# EasyEDA Pro project STM32F407VET6飞控.eprj

# Schematic STM32F407VET6飞控
Board Name: Board1; Create Date: 2025-07-30; Page Name: 核心原理图; Project Name: STM32F407VET6飞控; Schematic Name: STM32F407VET6飞控; Update Date: 2025-11-22; Company: 嘉立创EDA; Drawed: 黎佳鑫; Page Size: A4; Version: V1.0
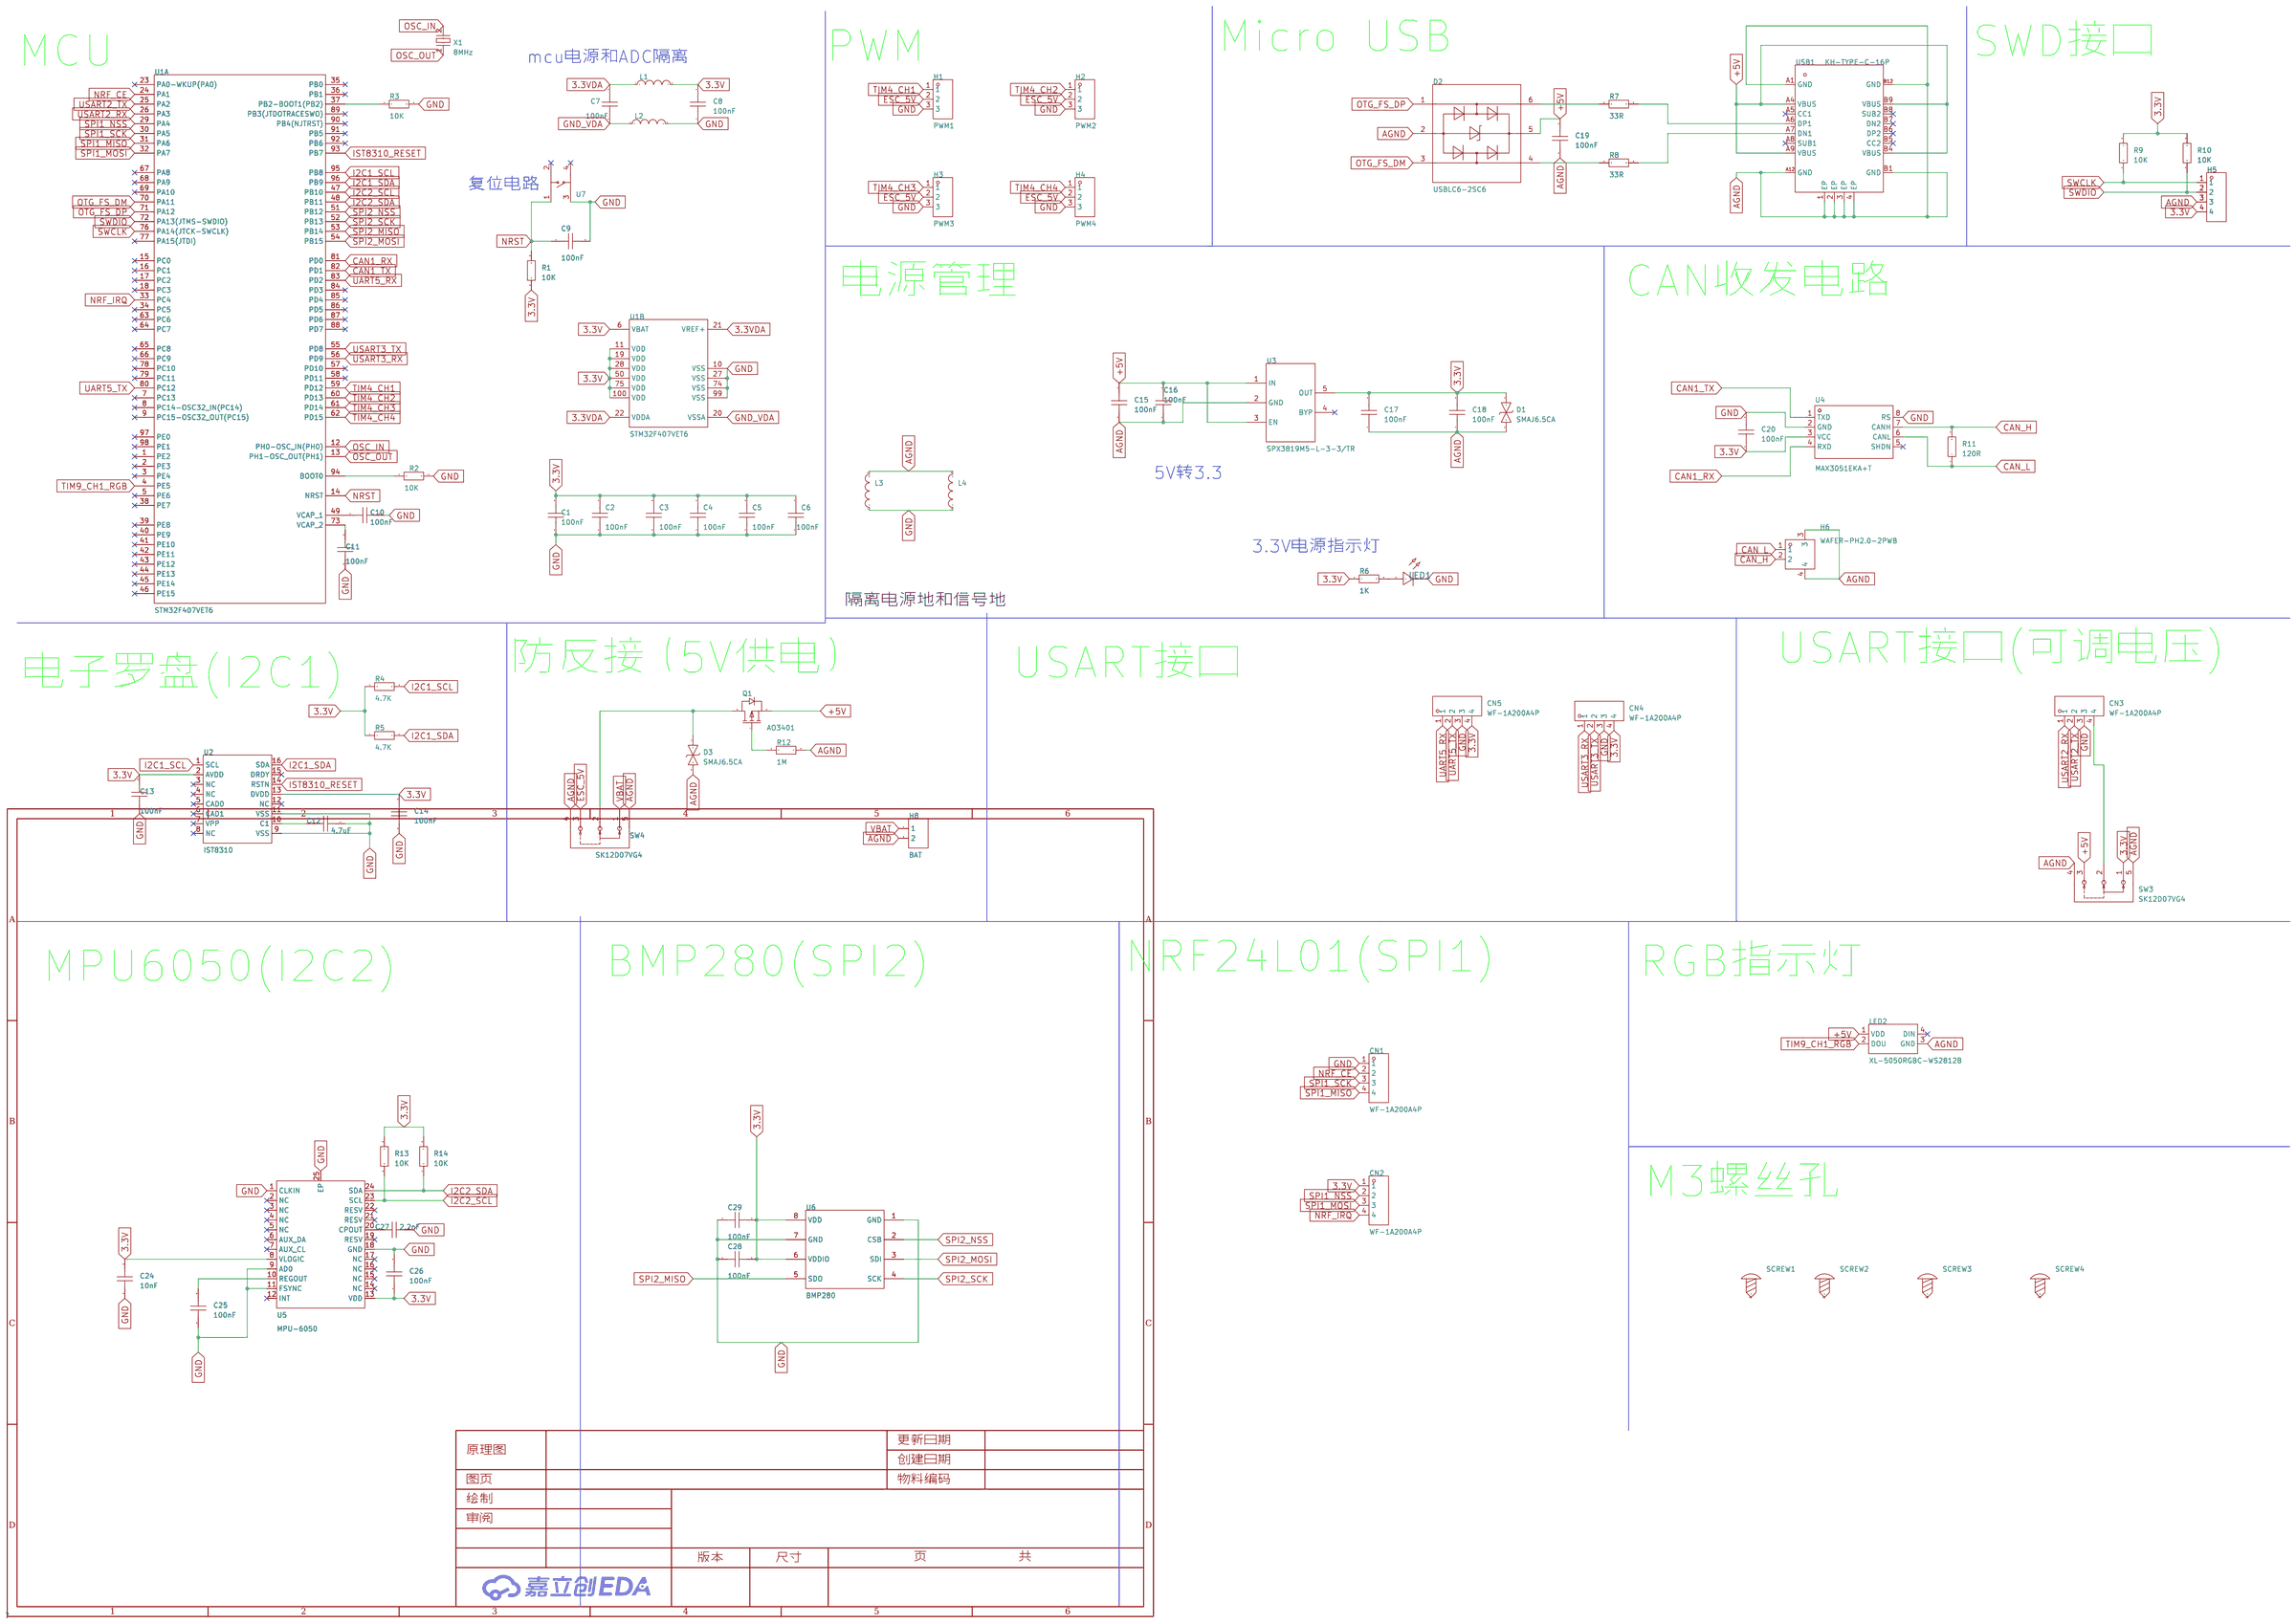
[diagram p0: schematic sheet]

## Parts
C1  100nF  [C0603]
C2  100nF  [C0603]
C3  100nF  [C0603]
C4  100nF  [C0603]
C5  100nF  [C0603]
C6  100nF  [C0603]
C7  100nF  [C0603]
C8  100nF  [C0603]
C9  100nF  [C0603]
C10  100nF  [C0603]
C11  100nF  [C0603]
C12  4.7uF  [C0603]
C13  100nF  [C0603]
C14  100nF  [C0603]
C15  100nF  [C0603]
C16  100nF  [C0603]
C17  100nF  [C0603]
C18  100nF  [C0603]
C19  100nF  [C0603]
C20  100nF  [C0603]
C24  10nF  [C0603]
C25  100nF  [C0603]
C26  100nF  [C0603]
C27  2.2nF  [C0603]
C28  100nF  [C0603]
C29  100nF  [C0603]
CN1  WF-1A200A4P  [CONN-TH_4P-P2.00_PH2.0-4P-1]
CN2  WF-1A200A4P  [CONN-TH_4P-P2.00_PH2.0-4P-1]
CN3  WF-1A200A4P  [CONN-TH_4P-P2.00_PH2.0-4P-1]
CN4  WF-1A200A4P  [CONN-TH_4P-P2.00_PH2.0-4P-1]
CN5  WF-1A200A4P  [CONN-TH_4P-P2.00_PH2.0-4P-1]
D1  SMAJ6.5CA  [SMA_L4.3-W2.7-LS5.0-BI]
D2  USBLC6-2SC6  [SOT-23-6_L2.9-W1.6-P0.95-LS2.8-BL]
D3  SMAJ6.5CA  [SMA_L4.3-W2.7-LS5.0-BI]
H1  PWM1  [HDR-TH_3P-P2.54-V-F]
H2  PWM2  [HDR-TH_3P-P2.54-V-F]
H3  PWM3  [HDR-TH_3P-P2.54-V-F]
H4  PWM4  [HDR-TH_3P-P2.54-V-F]
H5  -  [HDR-TH_4P-P2.54-V-F]
H6  WAFER-PH2.0-2PWB  [CONN-SMD_2P-P2.00_XUNPU_WAFER-PH2.0-2PWB]
H8  BAT  [HDR-TH_2P-P2.54-V-F]
L1  CBG160808U000T  [L0603]
L2  CBG160808U000T  [L0603]
L3  CBG160808U000T  [L0603]
L4  CBG160808U000T  [L0603]
LED1  -  [LED_0603]
LED2  XL-5050RGBC-WS2812B  [LED-SMD_4P-L5.0-W5.0-BL_XL-5050RGBC]
Q1  AO3401  [SOT-23-3_L2.9-W1.4-P1.90-LS2.6-BR]
R1  10K  [R0603]
R2  10K  [R0603]
R3  10K  [R0603]
R4  4.7K  [R0603]
R5  4.7K  [R0603]
R6  1K  [R0603]
R7  33R  [R0603]
R8  33R  [R0603]
R9  10K  [R0603]
R10  10K  [R0603]
R11  120R  [R0603]
R12  1M  [R0603]
R13  10K  [R0603]
R14  10K  [R0603]
SCREW1  -  [M3螺丝]
SCREW2  -  [M3螺丝]
SCREW3  -  [M3螺丝]
SCREW4  -  [M3螺丝]
SW3  SK12D07VG4  [SW-TH_SK12D07VG4]
SW4  SK12D07VG4  [SW-TH_SK12D07VG4]
U1  STM32F407VET6  [LQFP-100_L14.0-W14.0-P0.50-LS16.0-BL]  (sections 1,2)
U2  IST8310  [LGA-16_L3.0-W3.0-P0.50-BL_SQ]
U3  SPX3819M5-L-3-3/TR  [SOT-23-5_L3.0-W1.7-P0.95-LS2.8-BL]
U4  MAX3051EKA+T  [SOT-23-8_L3.0-W1.7-P0.65-LS2.8-TL]
U5  MPU-6050  [QFN-24_L4.0-W4.0-P0.50-BL-EP2.7]
U6  BMP280  [LGA-8_L2.5-W2.0-P0.65_AMP6127]
U7  TPS645-5NC60  [SW-SMD_4P-L6.0-W6.0-P4.50-LS9.2]
USB1  KH-TYPE-C-16P  [USB-C-SMD_KH-TYPE-C-16P]
X1  8MHz  [OSC-SMD_2P-L3.2-W2.5]

## Library data of the parts
C1-C20 C24-C29 = CAP_0603: Supplier Footprint: 0603
CN1-CN5 = WF-1A200A4P: LCSC Part Name: 间距2.0mm 直插 1x4P; Supplier Part: C23396960; Manufacturer: BXCONN(宝讯); Supplier Footprint: 插件,P=2mm; JLCPCB Part Class: 扩展库; Datasheet: https://atta.szlcsc.com/upload/public/pdf/source/20240628/5C536E6C8BD8BF2E5C6C6F2EC1BCB864.pdf; Supplier: LCSC; Pins Structure: 1x4P; Pitch: 2mm; Mounting Style: 直插; Reference Series: PH; Number of Pins: 4P; Number of Rows: 1; Number of PINs Per Row: 4; Current Rating (Max): 2A; Contact Material: 黄铜; Contact Plating: 锡; Operating Temperature Range: -25℃~+85℃
D1 D3 = SMAJ6.5CA_C908811: LCSC Part Name: 双向TVS 6.5V截止 35.7A峰值脉冲; Supplier Part: C908811; Manufacturer: GOODWORK(固得沃克); Supplier Footprint: SMA(DO-214AC); JLCPCB Part Class: 扩展库; Datasheet: https://atta.szlcsc.com/upload/public/pdf/source/20250421/E5E6656BCE61AA6110B0AF0D0BBE47DA.pdf; Supplier: LCSC; Reverse Stand-Off Voltage (Vrwm): 6.5V; Clamping Voltage: 11.2V; Peak Pulse Current (Ipp): 35.7A; Peak Pulse Power Dissipation (Ppp): 400W; Voltage - Breakdown: 7.22V; Reverse Leakage Current (Ir): 500uA; Operating Temperature: -55℃~+150℃@(Tj); Type: TVS
D2 = USBLC6-2SC6_C7519: LCSC Part Name: 单向ESD; Supplier Part: C7519; Manufacturer: ST(意法半导体); Supplier Footprint: SOT-23-6; JLCPCB Part Class: 扩展库; Datasheet: https://atta.szlcsc.com/upload/public/pdf/source/20140724/1457707160627.pdf; Supplier: LCSC; polarity: 单向; Reverse Stand-Off Voltage (Vrwm): 5.25V; Maximum Clamping Voltage: 17V; Peak Pulse Current (Ipp)@10/1000us: 5A; Breakdown Voltage: 6V; Number of Lines: 双路; Operating Temperature: -40℃~+125℃@(Tj); Type: ESD
H1-H4 = HDR-F_2.54_1x3P: Supplier Part: C541850; Supplier Footprint: 插件
H5 = HDR-F_2.54_1x4P: Supplier Part: C2718488; Supplier Footprint: 插件
H6 = WAFER-PH2.0-2PWB: LCSC Part Name: 1x2P 间距:2mm 卧贴 系列:PH; Supplier Part: C3029440; Manufacturer: XUNPU(讯普); Supplier Footprint: SMD,P=2mm,卧贴; JLCPCB Part Class: 扩展库; Datasheet: https://atta.szlcsc.com/upload/public/pdf/source/20220527/83903C18429EFE4C9EEE8C529A248431.pdf; Supplier: LCSC; Pins Structure: 1x2P; Pitch: 2mm; Mounting Type: 卧贴; Reference Series: PH; Number of Pins: 2P; Number of Rows: 1; Number of PINs Per Row: 2; Current Rating: 2A; Contact Material: 黄铜; Operating Temperature: -25℃~+85℃; Voltage Rating: 250V; Plastic Material: LCP; Supplementary Features: 辅助焊脚; Color: 米色; Z-Height of the Board: 5.6mm; X-Length of Bottom Edge on Board (Spacing Line): 8mm; Y-Width of Bottom Edge on Board: 8.5mm
H8 = HDR-F_2.54_1x2P: Supplier Part: C49661; Supplier Footprint: 插件
L1-L4 = CBG160808U000T: LCSC Part Name: 单路 0603磁珠 阻抗0Ω@100MHz; Supplier Part: C43163; Manufacturer: FH(风华); Supplier Footprint: 0603; JLCPCB Part Class: 扩展库; Datasheet: https://atta.szlcsc.com/upload/public/pdf/source/20190129/C361667_1614D407CC98D1D3CFBD9E1F7511C14D.pdf; Supplier: LCSC; Impedance @ Frequency: 0Ω@100MHz; DC Resistance: 100mΩ; Current Rating: 800mA; Circuits: 1
LED1 = LED_0603-R: Supplier Footprint: 0603
LED2 = XL-5050RGBC-WS2812B: Supplier Part: C2843785; Manufacturer: XINGLIGHT(成兴光); Supplier Footprint: SMD5050; JLCPCB Part Class: 扩展库; Datasheet: https://atta.szlcsc.com/upload/public/pdf/source/20240412/E1004CAA80592E31D08BFE019083806F.pdf; Supplier: LCSC
Q1 = AO3401_C727156: 类型:P沟道;漏源电压(Vdss):30V;连续漏极电流(Id):4.2A;功率(Pd):350mW;导通电阻(RDS(on)@Vgs,Id):65mΩ@10V,4.2A;阈值电压(Vgs(th)@Id):1.3V@250uA;; LCSC Part Name: P沟道 耐压:30V 电流:4.2A; Supplier Part: C727156; Manufacturer: TWGMC(台湾迪嘉); Supplier Footprint: SOT-23; JLCPCB Part Class: 扩展库; Datasheet: https://atta.szlcsc.com/upload/public/pdf/source/20200827/C727156_6E081BBEEFBC6B8FEE164CB196B0AF30.pdf; Supplier: LCSC; Type: P沟道; Drain Source Voltage (Vdss): 30V; Continuous Drain Current (Id): 4.2A; Power Dissipation (Pd): 350mW; Drain Source On Resistance (RDS(on)@Vgs,Id): 65mΩ@10V,4.2A; Gate Threshold Voltage (Vgs(th)@Id): 1.3V@250uA
R1-R14 = Res_0603: Supplier Footprint: 0603
SCREW1-SCREW4 = M3螺丝: Supplier Footprint: 插件
SW3 SW4 = SK12D07VG4: 电路结构:单刀双掷;安装方式:-;额定电流(DC):500mA;额定电压(DC):50V;额定电流(AC):-;额定电压(AC):-;机械寿命:5千次;; LCSC Part Name: 3脚2档位 卧插 滑动开关; Supplier Part: C393937; Manufacturer: SHOU HAN(首韩); Supplier Footprint: 插件; Datasheet: https://atta.szlcsc.com/upload/public/pdf/source/20190521/C393937_939FE26E571CC67D2D532E953108A1B0.pdf; Supplier: LCSC; Circuit: 单刀双掷; Actuator Style: 矩形柱状; Pin Style: PC引脚; Switch Height: 8.8mm; Current Rating (DC): 500mA; Voltage Rating (DC): 50V; Mechanical Life: 5千次
U1 = STM32F407VET6: LCSC Part Name: 带DSP和FPU的高性能基础系列ARM Cortex-M4 MCU，具有512 KB Flash、168 MHz CPU、ART加速器、以太网和FSMC; Supplier Part: C28730; Manufacturer: ST(意法半导体); Supplier Footprint: LQFP-100(14x14); JLCPCB Part Class: 扩展库; Datasheet: https://atta.szlcsc.com/upload/public/pdf/source/20140801/1457707197138.pdf; Supplier: LCSC; CPU Core: ARM-M4; CPU Maximum Speed: 168MHz; Program Storage Size: 512KB; Program Memory Type: FLASH; Number of I/O: 82; ADC (Bit): 12bit; DAC (Bit): 12bit; Voltage - Supply: 1.8V~3.6V
U2 = IST8310_C2683055: Supplier Part: C2683055; Manufacturer: iSentek(爱盛科技); Supplier Footprint: LGA-16(3x3); JLCPCB Part Class: 扩展库; Datasheet: https://atta.szlcsc.com/upload/public/pdf/source/20250224/70FB1E25A3B1BEF4BDD1315496E152E4.pdf; Supplier: LCSC
U3 = SPX3819M5-L-3-3/TR: LCSC Part Name: 输入16V 输出3.3V 500mA; Supplier Part: C9055; Manufacturer: MaxLinear(迈凌); Supplier Footprint: SOT-23-5; JLCPCB Part Class: 扩展库; Datasheet: https://atta.szlcsc.com/upload/public/pdf/source/20150720/1457707331934.pdf; Supplier: LCSC; Output Type: 固定; Voltage - Supply: 16V; Output Voltage: 3.3V; Output Current: 500mA; Power Supply Rejection Ratio (PSRR): 70dB; Voltage Dropout: 340mV@(500mA); standby current: 90uA; Noise: 40uVrms; Features: 带使能；过热保护；过流保护; Operating Temperature: -40℃~+125℃; Output Configuration: 正极; Number of Outputs: 1
U4 = MAX3051EKA+T: LCSC Part Name: MAX3051 +3.3V, 1Mbps, 低电源电流 CAN 收发器; Supplier Part: C112005; Manufacturer: ADI(亚德诺)/MAXIM(美信); Supplier Footprint: SOT-23-8; JLCPCB Part Class: 扩展库; Datasheet: https://atta.szlcsc.com/upload/public/pdf/source/20180126/C143406_15169558780381308928.pdf; Supplier: LCSC; Type: CAN收发器; Data Rate: 1Mbps; Supply Voltage: 3.3V; Supply Current: 35mA; Operating Temperature: -40℃~+85℃
U5 = MPU-6050: Supplier Part: C24112; Manufacturer: TDK InvenSense(应美盛); Supplier Footprint: QFN-24-EP(4x4); JLCPCB Part Class: 扩展库; Datasheet: https://atta.szlcsc.com/upload/public/pdf/source/20140425/1457707046159.pdf; Supplier: LCSC; Sensor Type: 加速度计陀螺仪; Operating Temperature: -40℃~+85℃
U6 = BMP280: LCSC Part Name: BMP280 停产; Supplier Part: C83291; Manufacturer: Bosch(博世); Supplier Footprint: LGA-8(2x2.5); JLCPCB Part Class: 扩展库; Datasheet: https://atta.szlcsc.com/upload/public/pdf/source/20200702/C83291_F39E84AB7DFC569A4C7554F8659640A1.pdf; Supplier: LCSC
U7 = TPS645-5NC60: LCSC Part Name: 6X6X6H 260克力 贴片轻触开关; Supplier Part: C19191552; Manufacturer: ROCPU Switches(台普); JLCPCB Part Class: 扩展库; Datasheet: https://atta.szlcsc.com/upload/public/pdf/source/20231204/193B3ACAB5A471A76A9359FBA22C7A2C.pdf; Supplier: LCSC
USB1 = KH-TYPE-C-16P: LCSC Part Name: Type-C 母 卧贴; Supplier Part: C709357; Manufacturer: kinghelm(金航标); Supplier Footprint: SMD; JLCPCB Part Class: 扩展库; Datasheet: https://atta.szlcsc.com/upload/public/pdf/source/20200911/C709357_AA8DCEB38BB20E3035A7ED7AE7667837.pdf; Supplier: LCSC; Connector Type: Type-C; Gender: 母; Number of Ports: 1; Number of Contacts: 16P; Mounting Style: 卧贴; Current Rating - Power (Max): 3A; Operating Temperature Range: -40℃~+85℃
X1 = NX3225GD-8MHZ-STD-CRA-3: LCSC Part Name: 8MHz ±50ppm 8pF; Supplier Part: C889706; Manufacturer: NDK; Supplier Footprint: SMD3225; JLCPCB Part Class: 扩展库; Datasheet: https://atta.szlcsc.com/upload/public/pdf/source/20210205/C889706_FEAF4038166E7D972418682387F0E295.pdf; Supplier: LCSC; Normal temperature Frequency Tolerance: ±50ppm; External load capacitor: 8pF; Frequency Stability(Full temperature range): ±150ppm; Equivalent Series Resistance (ESR): 500Ω; Operating Temperature: -40℃~+150℃

## Nets
3.3V: C1.2 C2.2 C3.2 C4.2 C5.2 C6.2 C8.2 C13.2 C14.2 C17.2 C18.2 C20.1 C24.2 C26.1 C28.2 C29.2 CN2.1 CN4.4 CN5.4 D1.1 H5.4 L1.2 R1.1 R4.1 R5.1 R6.1 R9.2 R10.2 R13.2 R14.2 SW3.1 U1.6(VBAT) U1.11(VDD) U1.19(VDD) U1.28(VDD) U1.50(VDD) U1.75(VDD) U1.100(VDD) U2.2(AVDD) U2.13(DVDD) U3.5(OUT) U4.3(VCC) U5.8(VLOGIC) U5.13(VDD) U6.6(VDDIO) U6.8(VDD)
3.3VDA: C7.2 L1.1 U1.21(VREF+) U1.22(VDDA)
+5V: C15.2 C16.2 C19.2 D2.5 LED2.1(VDD) Q1.2(S) SW3.3 U3.1(IN) U3.3(EN) USB1.A4(VBUS) USB1.A9(VBUS) USB1.B4(VBUS) USB1.B9(VBUS)
AGND: C15.1 C16.1 C17.1 C18.1 C19.1 D1.2 D2.2 D3.2 H5.3 H6.3 H6.4 H8.2 L3.2 L4.2 LED2.3(GND) R12.2 SW3.4 SW3.5 SW4.4 SW4.5 U3.2(GND) USB1.1(EP) USB1.2(EP) USB1.3(EP) USB1.4(EP) USB1.A1(GND) USB1.A12(GND) USB1.B1(GND) USB1.B12(GND)
GND: C1.1 C2.1 C3.1 C4.1 C5.1 C6.1 C8.1 C9.2 C10.2 C11.2 C12.2 C13.1 C14.1 C20.2 C24.1 C25.1 C26.2 C27.2 C28.1 C29.1 CN1.1 CN3.3 CN4.3 CN5.3 H1.3 H2.3 H3.3 H4.3 L2.2 L3.1 L4.1 LED1.1(C) R2.2 R3.2 U1.10(VSS) U1.27(VSS) U1.74(VSS) U1.99(VSS) U2.9(VSS) U2.11(VSS) U4.2(GND) U4.8(RS) U5.1(CLKIN) U5.9(AD0) U5.11(FSYNC) U5.18(GND) U5.25(EP) U6.1(GND) U6.7(GND) U7.3
GND_VDA: C7.1 L2.1 U1.20(VSSA)
VBAT: H8.1 SW4.1
CAN1_RX: U1.81(PD0) U4.4(RXD)
CAN1_TX: U1.82(PD1) U4.1(TXD)
CAN_H: H6.2 R11.2 U4.7(CANH)
CAN_L: H6.1 R11.1 U4.6(CANL)
ESC_5V: H1.2 H2.2 H3.2 H4.2 SW4.3
I2C1_SCL: R4.2 U1.95(PB8) U2.1(SCL)
I2C1_SDA: R5.2 U1.96(PB9) U2.16(SDA)
I2C2_SCL: R13.1 U1.47(PB10) U5.23(SCL)
I2C2_SDA: R14.1 U1.48(PB11) U5.24(SDA)
IST8310_RESET: U1.93(PB7) U2.14(RSTN)
NRF_CE: CN1.2 U1.24(PA1)
NRF_IRQ: CN2.4 U1.33(PC4)
NRST: C9.1 R1.2 U1.14(NRST) U7.1
OSC_IN: U1.12(PH0-OSC_IN(PH0)) X1.2(GND)
OSC_OUT: U1.13(PH1-OSC_OUT(PH1)) X1.1
OTG_FS_DM: D2.3 U1.70(PA11)
OTG_FS_DP: D2.1 U1.71(PA12)
SPI1_MISO: CN1.4 U1.31(PA6)
SPI1_MOSI: CN2.3 U1.32(PA7)
SPI1_NSS: CN2.2 U1.29(PA4)
SPI1_SCK: CN1.3 U1.30(PA5)
SPI2_MISO: U1.53(PB14) U6.5(SDO)
SPI2_MOSI: U1.54(PB15) U6.3(SDI)
SPI2_NSS: U1.51(PB12) U6.2(CSB)
SPI2_SCK: U1.52(PB13) U6.4(SCK)
SWCLK: H5.1 R9.1 U1.76(PA14(JTCK-SWCLK))
SWDIO: H5.2 R10.1 U1.72(PA13(JTMS-SWDIO))
TIM4_CH1: H1.1 U1.59(PD12)
TIM4_CH2: H2.1 U1.60(PD13)
TIM4_CH3: H3.1 U1.61(PD14)
TIM4_CH4: H4.1 U1.62(PD15)
TIM9_CH1_RGB: LED2.2(DOU) U1.4(PE5)
UART5_RX: CN5.1 U1.83(PD2)
UART5_TX: CN5.2 U1.80(PC12)
USART2_RX: CN3.1 U1.26(PA3)
USART2_TX: CN3.2 U1.25(PA2)
USART3_RX: CN4.1 U1.56(PD9)
USART3_TX: CN4.2 U1.55(PD8)
$1N3277: C10.1 U1.49(VCAP_1)
$1N3303: C11.1 U1.73(VCAP_2)
$1N3409: R2.1 U1.94(BOOT0)
$1N3477: R3.1 U1.37(PB2-BOOT1(PB2))
$1N4200: C12.1 U2.10(C1)
$1N5779: LED1.2(A) R6.2
$1N6508: R8.2 USB1.A7(DN1)
$1N6514: D2.4 R8.1
$1N6519: D2.6 R7.1
$1N6527: R7.2 USB1.A6(DP1)
$1N7769: D3.1 Q1.3(D) SW4.2
$1N7822: Q1.1(G) R12.1
$1N8748: CN3.4 SW3.2
$1N9159: C25.2 U5.10(REGOUT)
$1N9286: C27.1 U5.20(CPOUT)

Not connected (* = marked no-connect by the designer): LED2 4(DIN)*; SCREW1 1; SCREW2 1; SCREW3 1; SCREW4 1; U1 1(PE2)* 2(PE3)* 3(PE4)* 5(PE6)* 7(PC13)* 8(PC14-OSC32_IN(PC14))* 9(PC15-OSC32_OUT(PC15))* 15(PC0)* 16(PC1)* 17(PC2)* 18(PC3)* 23(PA0-WKUP(PA0))* 34(PC5)* 35(PB0)* 36(PB1)* 38(PE7)* 39(PE8)* 40(PE9)* 41(PE10)* 42(PE11)* 43(PE12)* 44(PE13)* 45(PE14)* 46(PE15)* 57(PD10)* 58(PD11)* 63(PC6)* 64(PC7)* 65(PC8)* 66(PC9)* 67(PA8)* 68(PA9)* 69(PA10)* 77(PA15(JTDI))* 78(PC10)* 79(PC11)* 84(PD3)* 85(PD4)* 86(PD5)* 87(PD6)* 88(PD7)* 89(PB3(JTDOTRACESWO))* 90(PB4(NJTRST))* 91(PB5)* 92(PB6)* 97(PE0)* 98(PE1)*; U2 3(NC)* 4(NC)* 5(CAD0)* 6(CAD1)* 7(VPP)* 8(NC)* 12(NC)* 15(DRDY)*; U3 4(BYP)*; U4 5(SHDN)*; U5 2(NC)* 3(NC)* 4(NC)* 5(NC)* 6(AUX_DA)* 7(AUX_CL)* 12(INT)* 14(NC)* 15(NC)* 16(NC)* 17(NC)* 19(RESV)* 21(RESV)* 22(RESV)*; U7 2* 4*; USB1 A5(CC1)* A8(SUB1)* B5(CC2)* B6(DP2)* B7(DN2)* B8(SUB2)*

## Notes on the sheet
- Micro USB
- mcu电源和ADC隔离
- PWM
- SWD接口
- MCU
- 复位电路
- 电源管理
- CAN收发电路
- 5V转3.3
- 3.3V电源指示灯
- 隔离电源地和信号地
- USART接口(可调电压)
- 防反接（5V供电）
- USART接口
- 电子罗盘(I2C1)
- BMP280(SPI2)
- NRF24L01(SPI1)
- RGB指示灯
- MPU6050(I2C2)
- M3螺丝孔

# Board STM32F407VET6飞控
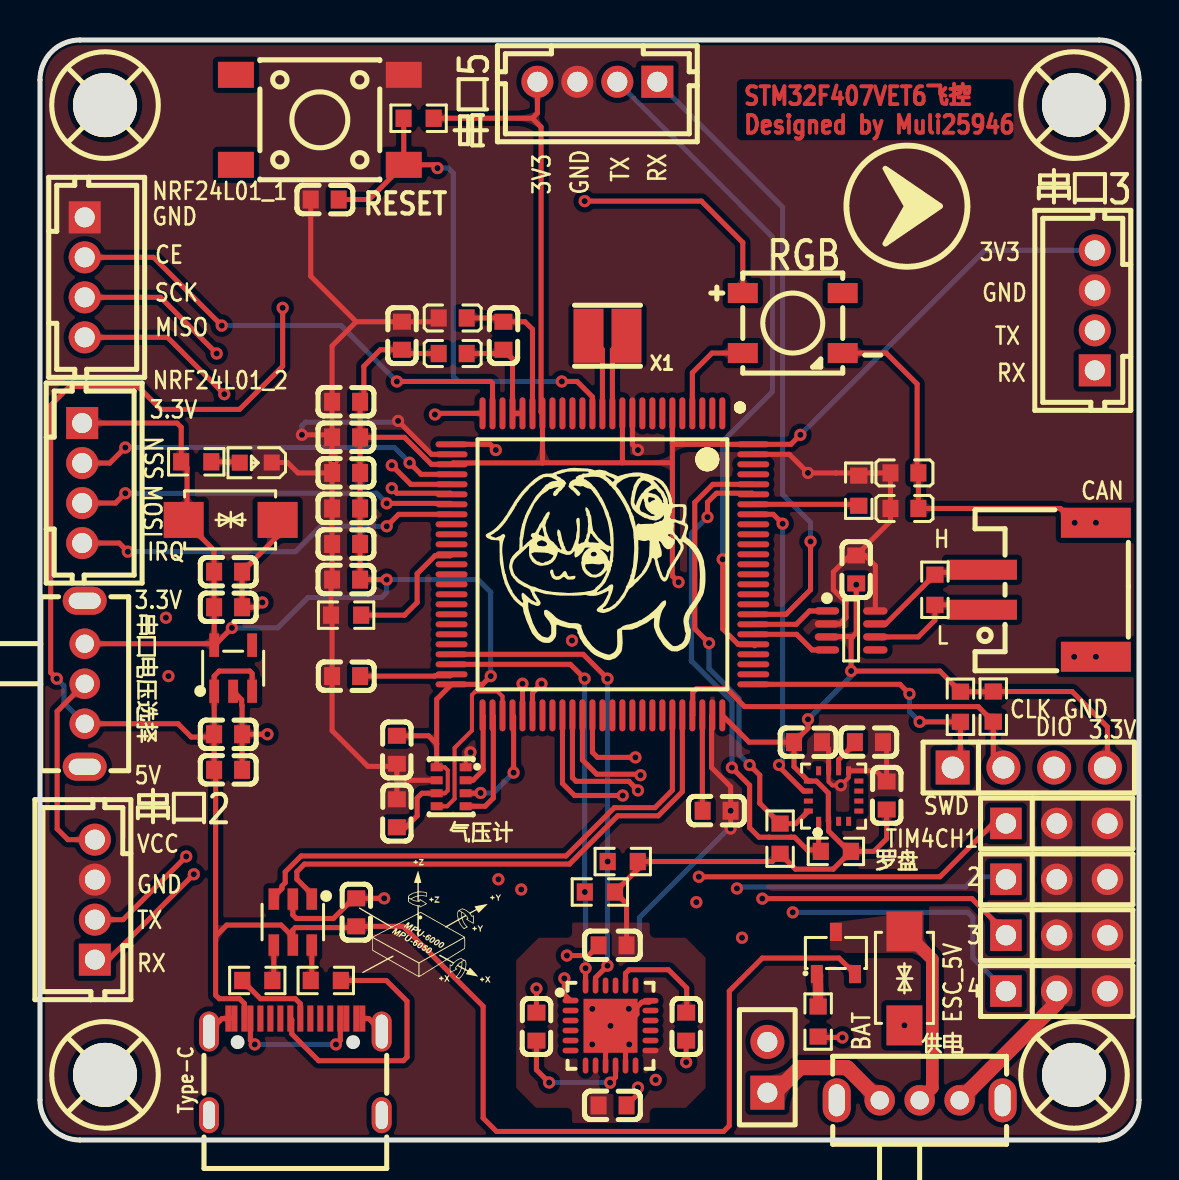
[diagram p1: board, top side]
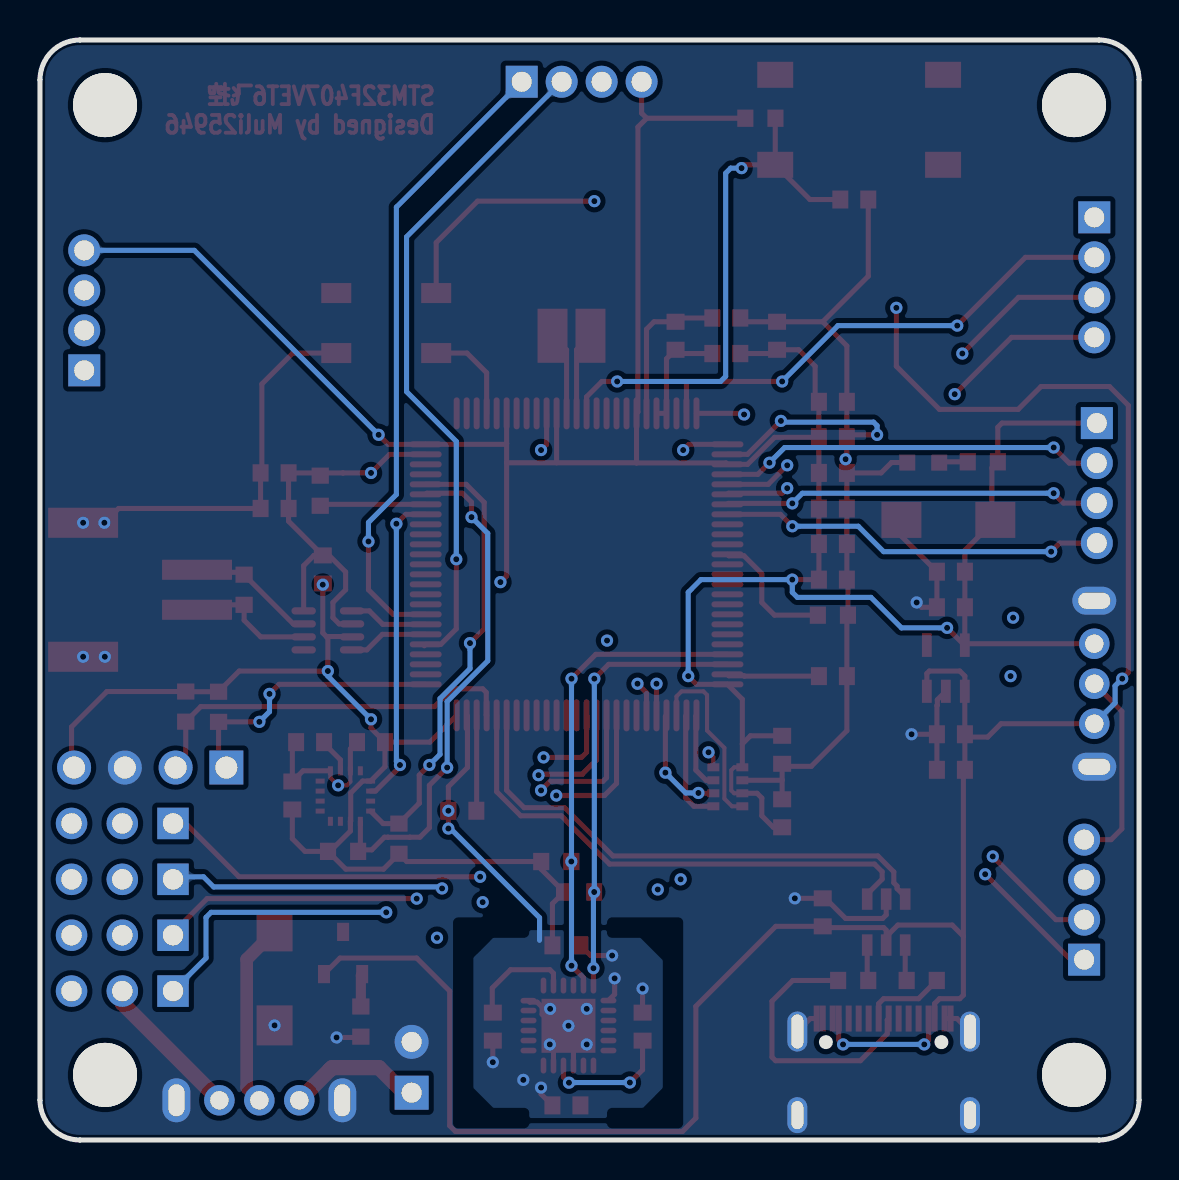
[diagram p2: board, bottom side, seen from below]

Outline 55 x 55 mm; copper layers: Top Layer, Inner1, Inner2, Bottom Layer. Coordinates in mm from the lower left corner of the outline.
Outline path: 0,53 0,2 arc(0.59,0.59) 2,0 53,0 arc(54.41,0.59) 55,2 55,53 arc(54.41,54.41) 53,55 2,55 arc(0.59,54.41) 0,53
Stack: Top Layer 0.035mm 外层铜厚1oz / Dielectric1 0.2104mm 7628 RC49% 8.6mil / Inner1 0.0152mm 内层铜厚 / Dielectric2 1.065mm 1.1mm H/HOZ Copper / Inner2 0.0152mm 内层铜厚 / Dielectric3 0.2104mm 7628 RC49% 8.6mil / Bottom Layer 0.035mm 外层铜厚1oz

## Design rules (mm)
net OTG_FS_DP: DP1
net OTG_FS_DM: DP1
net CAN_L: DP3
net CAN_H: DP3
net CAN1_TX: DP2
net CAN1_RX: DP2
template: 自定义配置
spacing copperThickness1oz (default): track to track 0.102, other pairs 0.152 to 0.3
spacing copperThickness2oz: track to track 0.203, other pairs 0.152 to 0.3
track width copperThickness1oz (default): min 0.127, default 0.254, max 2.54
track width copperThickness2oz: min 0.203, default 0.254, max 2.54
differential pair differentialPair (default): width min 0.127, default 0.254, max 2.54; gap min 0.152, default 0.152
via viaSize (default): diameter min 0.5, default 0.61, max 10; hole min 0.3, default 0.305, max 6.3

## Placement (name value [footprint] x y rotation side)
C1  100nF  [C0603]  15.32 36.91 0 top
C2  100nF  [C0603]  15.32 35.13 0 top
C3  100nF  [C0603]  15.32 33.35 0 top
C4  100nF  [C0603]  15.32 31.58 0 top
C5  100nF  [C0603]  15.32 29.8 0 top
C6  100nF  [C0603]  15.32 28.02 0 top
C7  100nF  [C0603]  23.19 40.21 270 top
C8  100nF  [C0603]  18.11 40.21 270 top
C9  100nF  [C0603]  14.25 47.02 180 top
C10  100nF  [C0603]  15.32 23.19 180 top
C11  100nF  [C0603]  33.86 16.46 0 top
C12  4.7uF  [C0603]  41.48 19.89 0 top
C13  100nF  [C0603]  38.43 19.89 180 top
C14  100nF  [C0603]  42.37 17.23 270 top
C15  100nF  [C0603]  9.41 18.51 180 top
C16  100nF  [C0603]  9.41 20.29 180 top
C17  100nF  [C0603]  9.41 26.64 180 top
C18  100nF  [C0603]  9.41 28.42 180 top
C19  100nF  [C0603]  15.83 11.38 270 top
C20  100nF  [C0603]  40.85 28.53 90 top
C24  10nF  [C0603]  28.65 9.73 0 top
C25  100nF  [C0603]  24.84 5.67 270 top
C26  100nF  [C0603]  28.65 1.73 0 top
C27  2.2nF  [C0603]  32.34 5.67 270 top
C28  100nF  [C0603]  17.86 16.34 270 top
C29  100nF  [C0603]  17.86 19.51 90 top
CN1  WF-1A200A4P  [CONN-TH_4P-P2.00_PH2.0-4P-1]  2.24 43.13 90 top
CN2  WF-1A200A4P  [CONN-TH_4P-P2.00_PH2.0-4P-1]  2.11 32.85 90 top
CN3  WF-1A200A4P  [CONN-TH_4P-P2.00_PH2.0-4P-1]  2.75 12.02 270 top
CN4  WF-1A200A4P  [CONN-TH_4P-P2.00_PH2.0-4P-1]  52.79 41.48 270 top
CN5  WF-1A200A4P  [CONN-TH_4P-P2.00_PH2.0-4P-1]  27.89 52.91 0 top
D1  SMAJ6.5CA  [SMA_L4.3-W2.7-LS5.0-BI]  9.54 31 0 top
D2  USBLC6-2SC6  [SOT-23-6_L2.9-W1.6-P0.95-LS2.8-BL]  12.65 10.9 180 top
D3  SMAJ6.5CA  [SMA_L4.3-W2.7-LS5.0-BI]  43.26 8.08 270 top
H1  PWM1  [HDR-TH_3P-P2.54-V-F]  50.88 15.83 0 top
H2  PWM2  [HDR-TH_3P-P2.54-V-F]  50.88 13.03 0 top
H3  PWM3  [HDR-TH_3P-P2.54-V-F]  50.88 10.24 0 top
H4  PWM4  [HDR-TH_3P-P2.54-V-F]  50.88 7.45 0 top
H5  -  [HDR-TH_4P-P2.54-V-F]  49.48 18.62 0 top
H6  WAFER-PH2.0-2PWB  [CONN-SMD_2P-P2.00_XUNPU_WAFER-PH2.0-2PWB]  49.99 27.51 90 top
H8  BAT  [HDR-TH_2P-P2.54-V-F]  36.4 3.64 90 top
L1  CBG160808U000T  [L0603]  20.65 39.32 180 top
L2  CBG160808U000T  [L0603]  20.65 41.1 180 top
L3  CBG160808U000T  [L0603]  43.26 33.35 0 top
L4  CBG160808U000T  [L0603]  43.26 31.58 0 top
LED1  -  [LED_0603]  10.75 33.86 180 top
LED2  XL-5050RGBC-WS2812B  [LED-SMD_4P-L5.0-W5.0-BL_XL-5050RGBC]  37.67 40.85 270 top
Q1  AO3401  [SOT-23-3_L2.9-W1.4-P1.90-LS2.6-BR]  39.83 9.35 270 top
R1  10K  [R0603]  18.95 51.09 180 top
R2  10K  [R0603]  40.97 32.47 90 top
R3  10K  [R0603]  15.32 26.24 180 top
R4  4.7K  [R0603]  39.83 14.43 180 top
R5  4.7K  [R0603]  37.04 15.07 90 top
R6  1K  [R0603]  7.82 33.91 0 top
R7  33R  [R0603]  14.3 7.98 0 top
R8  33R  [R0603]  10.87 7.98 180 top
R9  10K  [R0603]  46.06 21.66 90 top
R10  10K  [R0603]  47.7 21.67 90 top
R11  120R  [R0603]  44.78 27.51 90 top
R12  1M  [R0603]  38.94 5.92 270 top
R13  10K  [R0603]  29.16 13.92 0 top
R14  10K  [R0603]  28.02 12.4 0 top
SCREW1  -  [M3螺丝]  3.25 3.26 0 top
SCREW2  -  [M3螺丝]  3.25 51.75 0 top
SCREW3  -  [M3螺丝]  51.74 51.75 0 top
SCREW4  -  [M3螺丝]  51.74 3.26 0 top
SW3  SK12D07VG4  [SW-TH_SK12D07VG4]  2.24 22.81 270 top
SW4  SK12D07VG4  [SW-TH_SK12D07VG4]  44.02 1.98 0 top
U1  STM32F407VET6  [LQFP-100_L14.0-W14.0-P0.50-LS16.0-BL]  28.15 28.78 180 top
U2  IST8310  [LGA-16_L3.0-W3.0-P0.50-BL_SQ]  39.72 17.2 0 top
U3  SPX3819M5-L-3-3/TR  [SOT-23-5_L3.0-W1.7-P0.95-LS2.8-BL]  9.67 23.59 0 top
U4  MAX3051EKA+T  [SOT-23-8_L3.0-W1.7-P0.65-LS2.8-TL]  40.59 25.48 0 top
U5  MPU-6050  [QFN-24_L4.0-W4.0-P0.50-BL-EP2.7]  28.55 5.72 270 top
U6  BMP280  [LGA-8_L2.5-W2.0-P0.65_AMP6127]  20.58 17.66 0 top
U7  TPS645-5NC60  [SW-SMD_4P-L6.0-W6.0-P4.50-LS9.2]  14.01 51.01 180 top
USB1  KH-TYPE-C-16P  [USB-C-SMD_KH-TYPE-C-16P]  12.78 3.66 0 top
X1  8MHz  [OSC-SMD_2P-L3.2-W2.5]  28.4 40.21 180 top

## Footprints (pads in the part's own frame, mm; a bottom-side part is the same pattern mirrored in y, then rotated)
C0603
  rect 0.8x0.9 smd: 1(-0.7,0) 2(0.7,0)
CONN-SMD_2P-P2.00_XUNPU_WAFER-PH2.0-2PWB
  rect 1x3.5 smd: 1(-1,2.85) 2(1,2.85)
  rect 1.5x3.5 smd: 3(-3.35,-2.85) 4(3.35,-2.85)
CONN-TH_4P-P2.00_PH2.0-4P-1
  rect 1.6x1.6 hole 1: 1(3,0)
  round 1.6 hole 1: 2(1,0) 3(-1,0) 4(-3,0)
HDR-TH_2P-P2.54-V-F
  rect 1.7x1.7 hole 1: 1(-1.27,0)
  round 1.7 hole 1: 2(1.27,0)
HDR-TH_3P-P2.54-V-F
  rect 1.575x1.575 hole 1.02: 1(-2.54,0)
  round 1.575 hole 1.02: 2(0,0) 3(2.54,0)
HDR-TH_4P-P2.54-V-F
  rect 1.7x1.7 hole 1.1: 1(-3.81,0)
  round 1.7 hole 1.1: 2(-1.27,0) 3(1.27,0) 4(3.81,0)
L0603
  rect 0.8x0.864 smd: 1(-0.7,0) 2(0.7,0)
LED-SMD_4P-L5.0-W5.0-BL_XL-5050RGBC
  rect 1x1.5 smd: 1(-1.5,-2.5) 2(1.5,-2.5) 3(1.5,2.5) 4(-1.5,2.5)
LED_0603
  rect 0.8x0.8 smd: 1(-0.851,-0.01) 2(0.75,-0.005)
LGA-8_L2.5-W2.0-P0.65_AMP6127
  rect 0.6x0.4 smd: 1(0.725,0.975) 2(0.725,0.325) 3(0.725,-0.325) 4(0.725,-0.975) 5(-0.725,-0.975) 6(-0.725,-0.325) 7(-0.725,0.325) 8(-0.725,0.975)
LGA-16_L3.0-W3.0-P0.50-BL_SQ
  rect 0.25x0.45 smd: 1(-0.75,-1.263) 2(-0.25,-1.263) 3(0.25,-1.263) 4(0.75,-1.263) 9(0.75,1.263) 10(0.25,1.263) 11(-0.25,1.263) 12(-0.75,1.263)
  rect 0.45x0.25 smd: 5(1.263,-0.75) 6(1.263,-0.25) 7(1.263,0.25) 8(1.263,0.75) 13(-1.263,0.75) 14(-1.263,0.25) 15(-1.263,-0.25) 16(-1.263,-0.75)
LQFP-100_L14.0-W14.0-P0.50-LS16.0-BL
  oval 0.3x1.6 smd: 1(-6,-7.55) 2(-5.5,-7.55) 3(-5,-7.55) 4(-4.5,-7.55) 5(-4,-7.55) 6(-3.5,-7.55) 7(-3,-7.55) 8(-2.5,-7.55) 9(-2,-7.55) 10(-1.5,-7.55) 11(-1,-7.55) 12(-0.5,-7.55) 13(0,-7.55) 14(0.5,-7.55) 15(1,-7.55) 16(1.5,-7.55) 17(2,-7.55) 18(2.5,-7.55) 19(3,-7.55) 20(3.5,-7.55) 21(4,-7.55) 22(4.5,-7.55) 23(5,-7.55) 24(5.5,-7.55) 25(6,-7.55) 51(6,7.55) 52(5.5,7.55) 53(5,7.55) 54(4.5,7.55) 55(4,7.55) 56(3.5,7.55) 57(3,7.55) 58(2.5,7.55) 59(2,7.55) 60(1.5,7.55) 61(1,7.55) 62(0.5,7.55) 63(0,7.55) 64(-0.5,7.55) 65(-1,7.55) 66(-1.5,7.55) 67(-2,7.55) 68(-2.5,7.55) 69(-3,7.55) 70(-3.5,7.55) 71(-4,7.55) 72(-4.5,7.55) 73(-5,7.55) 74(-5.5,7.55) 75(-6,7.55)
  oval 1.6x0.3 smd: 26(7.55,-6) 27(7.55,-5.5) 28(7.55,-5) 29(7.55,-4.5) 30(7.55,-4) 31(7.55,-3.5) 32(7.55,-3) 33(7.55,-2.5) 34(7.55,-2) 35(7.55,-1.5) 36(7.55,-1) 37(7.55,-0.5) 38(7.55,0) 39(7.55,0.5) 40(7.55,1) 41(7.55,1.5) 42(7.55,2) 43(7.55,2.5) 44(7.55,3) 45(7.55,3.5) 46(7.55,4) 47(7.55,4.5) 48(7.55,5) 49(7.55,5.5) 50(7.55,6) 76(-7.55,6) 77(-7.55,5.5) 78(-7.55,5) 79(-7.55,4.5) 80(-7.55,4) 81(-7.55,3.5) 82(-7.55,3) 83(-7.55,2.5) 84(-7.55,2) 85(-7.55,1.5) 86(-7.55,1) 87(-7.55,0.5) 88(-7.55,0) 89(-7.55,-0.5) 90(-7.55,-1) 91(-7.55,-1.5) 92(-7.55,-2) 93(-7.55,-2.5) 94(-7.55,-3) 95(-7.55,-3.5) 96(-7.55,-4) 97(-7.55,-4.5) 98(-7.55,-5) 99(-7.55,-5.5) 100(-7.55,-6)
M3螺丝
  round 3.2 hole 3.2: 1(0,0)
OSC-SMD_2P-L3.2-W2.5
  rect 1.5x2.7 smd: 1(0.95,0) 2(-0.95,0)
QFN-24_L4.0-W4.0-P0.50-BL-EP2.7
  oval 0.28x0.8 smd: 1(-1.25,-2) 2(-0.75,-2) 3(-0.25,-2) 4(0.25,-2) 5(0.75,-2) 6(1.25,-2) 13(1.25,2) 14(0.75,2) 15(0.25,2) 16(-0.25,2) 17(-0.75,2) 18(-1.242,2)
  oval 0.8x0.28 smd: 7(2,-1.25) 8(2,-0.75) 9(2,-0.25) 10(2,0.25) 11(2,0.75) 12(2,1.25) 19(-2,1.25) 20(-2,0.75) 21(-2,0.25) 22(-2,-0.25) 23(-2,-0.75) 24(-2,-1.25)
  rect 2.7x2.7 smd: 25(0.013,0)
R0603
  rect 0.806x0.864 smd: 1(-0.753,0) 2(0.753,0)
SMA_L4.3-W2.7-LS5.0-BI
  rect 2x1.8 smd: 1(-2.35,0) 2(2.35,0)
SOT-23-3_L2.9-W1.4-P1.90-LS2.6-BR
  rect 0.91x0.6 smd: 1(1.055,-0.955) 2(1.055,0.955) 3(-1.055,0)
SOT-23-5_L3.0-W1.7-P0.95-LS2.8-BL
  rect 0.49x1.157 smd: 1(-0.95,-1.153) 2(0,-1.153) 3(0.95,-1.153)
  rect 0.49x1.175 smd: 4(0.95,1.153) 5(-0.95,1.153)
SOT-23-6_L2.9-W1.6-P0.95-LS2.8-BL
  rect 0.532x1.072 smd: 1(-0.95,-1.149) 2(0,-1.149) 3(0.95,-1.149) 4(0.95,1.149) 5(0,1.149) 6(-0.95,1.149)
SOT-23-8_L3.0-W1.7-P0.65-LS2.8-TL
  oval 1.222x0.364 smd: 1(-1.211,0.975) 2(-1.211,0.325) 3(-1.211,-0.325) 4(-1.211,-0.975) 5(1.211,-0.975) 6(1.211,-0.325) 7(1.211,0.325) 8(1.211,0.975)
SW-SMD_4P-L6.0-W6.0-P4.50-LS9.2
  rect 1.8x1.3 smd: 1(-4.2,2.25) 2(4.2,2.25) 3(-4.2,-2.25) 4(4.2,-2.25)
SW-TH_SK12D07VG4
  round 1.524 hole 0.914: 1(-2,0) 2(0,0) 3(2,0)
  oval 1.4x2.2 hole 0.8x1.6: 4(4.15,0) 5(-4.15,0)
USB-C-SMD_KH-TYPE-C-16P
  oval 1x2 hole 0.6x1.7: 1(-4.32,1.765) 2(4.32,1.765)
  oval 1x1.8 hole 0.6x1.4: 3(-4.32,-2.415) 4(4.32,-2.415)
  rect 0.3x1.3 smd: A1(-3.35,2.415) A4(-2.55,2.415) A5(-1.25,2.415) A6(-0.25,2.415) A7(0.25,2.415) A8(1.25,2.415) A9(2.55,2.415) A12(3.35,2.415) B1(3.05,2.415) B4(2.25,2.415) B5(1.75,2.415) B6(0.75,2.415) B7(-0.75,2.415) B8(-1.75,2.415) B9(-2.25,2.415) B12(-3.05,2.415)

## Nets
As in the schematic.

Pads without a net: LED2 4; SCREW1 1; SCREW2 1; SCREW3 1; SCREW4 1; U1 1 2 3 5 7 8 9 15 16 17 18 23 34 35 36 38 39 40 41 42 43 44 45 46 57 58 63 64 65 66 67 68 69 77 78 79 84 85 86 87 88 89 90 91 92 97 98; U2 3 4 5 6 7 8 12 15; U3 4; U4 5; U5 2 3 4 5 6 7 12 14 15 16 17 19 21 22; U7 2 4; USB1 A5 A8 B5 B6 B7 B8

## Via types
v1: diameter 0.61, hole 0.305, Top Layer to Bottom Layer, 97 vias

## Routing (per net, layer and track width the routed paths; a pad name or vN(x,y) marks a point on that pad's centre or on a via; arc(x,y) is an arc through that point)
3.3V: length 217.1
  Top Layer w0.203: U6.8 20.26,18.64 20.41,18.49 20.41,17.48 20.26,17.34 19.85,17.34
  Top Layer w0.254: 24.64,51.09 24.89,51.34 CN5.4 ; 24.64,51.09 25.08,50.65 25.08,36.4 25.15,36.33 25.15,33.86 ; 24.64,51.09 R1.1 ; U4.3 39.4,25.17 40.67,25.17 ; v1(38.43,21.03) 38.43,20.59 C13.2 ; 29.36,9.73 29.36,11.82 R14.2 29.92,13.54 R13.2 36.65,13.92 R5.1 37.81,13.54 39.7,13.54 R4.1 ; 29.15,33.86 29.15,36.33 ; 29.15,33.86 25.15,33.86 ; 29.15,33.86 31.65,33.86 ; 31.65,33.86 31.65,28.2 v1(31.96,27.89) ; 31.65,33.86 31.65,34.82 ; v1(9.61,25.61) 8.74,24.74 U3.5 ; C2.2 C3.2 C4.2 C5.2 C6.2 v1(17.35,28.02) ; C2.2 C1.2 16.21,37.1 16.21,38.69 17.03,39.51 C8.2 18.3,39.32 L1.2 ; C2.2 18.24,35.13 19.59,33.78 U1.28 20.67,33.85 25.15,33.85 25.15,33.86 ; 19.85,19.8 19.45,20.21 C29.2 ; 19.85,19.8 19.85,22.04 U1.50 22.15,22.78 v1(22.56,23.19) ; 19.85,19.8 U6.8 ; D1.1 7.36,30.83 ; 7.36,30.83 7.36,33.61 7.07,33.91 7.07,35.64 6.86,35.85 CN2.1 ; 7.36,30.83 8.71,29.48 C18.2 C17.2 8.72,26.63 U3.5 ; 31.65,34.82 31.65,36.33 ; 31.65,34.82 31.69,34.78 37.58,34.78 v1(38.05,35.26) ; U3.5 8.65,24.81 SW3.1 ; 40.67,25.17 40.59,25.1 v1(40.59,23.45) 45.03,23.45 R9.2 47.7,22.41 R10.2 51.65,22.42 53.42,20.65 53.42,18.75 H5.4 ; 40.67,25.17 40.85,25.35 C20.1 ; U1.75 35.49,19.89 C13.2 ; C13.2 37.73,18.67 U2.13 38.86,17.95 39.45,17.35 39.45,15.95 U2.2 39.47,15.45 40.48,14.43 R4.1 ; U6.6 19.11,17.34 18.88,17.1 18.88,16.21 18.3,15.64 C28.2 ; C14.2 42.37,15.07 41.74,14.43 R4.1
  Inner2 w0.254: v1(31.96,27.89) 40.72,27.89 v1(40.85,27.77)
  Bottom Layer w0.254: v1(22.56,23.19) 22.56,27.39 21.92,28.02 v1(17.35,28.02) 17.35,27.39 17.1,27.13 13.42,27.13 11.89,25.61 v1(9.61,25.61) ; CN4.4 47.28,44.48 v1(38.05,35.26) ; v1(40.59,23.45) 40.59,23.19 v1(38.43,21.03)
3.3VDA: length 5.8
  Top Layer w0.254: 24.15,36.33 23.65,36.33 23.65,39.06 C7.2 23.01,39.32 L1.1
+5V: length 145.1
  Top Layer w0.254: C16.2 8.72,20.29 U3.1 8.72,22.44 8.72,23.19 8.97,23.45 10.49,23.45 10.62,23.32 U3.3 ; C16.2 C15.2 8.79,18.43 8.79,10.19 ; C16.2 8.57,20.15 7.57,20.15 6.91,20.81 SW3.3 ; 12.65,10.16 12.07,10.75 9.35,10.75 8.79,10.19 ; 12.65,10.16 12.65,10.49 12.78,10.62 15.77,10.62 C19.2 18.18,10.68 22.18,6.68 22.18,1.1 22.85,0.43 34.21,0.43 34.5,0.72 34.5,7.45 36.15,9.1 39.98,9.1 40.79,8.3 ; 12.65,10.16 D2.5 ; 8.79,10.19 8.79,7.24 8.97,7.06 9.99,7.06 10.23,6.82 USB1.A4 ; v1(27.26,46.94) 33.1,46.94 35.17,44.87 LED2.1 ; v1(10.75,4.78) 10.53,5 USB1.B9 ; v1(14.81,4.78) 15.03,5 USB1.B4 ; v1(0.84,23.07) 0.54,23.37 0.54,36.73 1.48,37.67 4.91,37.67 6.05,36.53 9.99,36.53 12.14,38.69 v1(12.14,41.61)
  Inner2 w0.254: v1(27.26,46.94) 17.48,46.94 v1(12.14,41.61)
  Bottom Layer w0.254: v1(0.84,23.07) 1.2,22.71 1.2,21.85 SW3.3 ; v1(14.81,4.78) v1(10.75,4.78)
AGND: length 40.2
  Top Layer w0.254: v1(17.23,12.08) C19.1 15.69,12.08 14.68,11.08 12.83,11.08 12.65,11.26 D2.2 ; USB1.A12 16.45,6.07 USB1.2 ; v1(40.16,5.13) 38.94,5.13 ; USB1.B12 USB1.A1 9.11,6.07 USB1.1 ; D1.2 11.89,30.19 C18.1 C17.1 10.89,26.64 v1(11.13,26.88) ; LED2.3 42.35,39.35 43.89,37.8 43.89,33.42 L3.2 L4.2 51.06,31.58 v1(51.78,30.86) ; C16.1 v1(11.38,20.29) ; C16.1 C15.1 ; C16.1 10.11,21.72 10.09,21.74 10.09,22.01 U3.2
  vias: v1(43.26,5.73) v1(51.75,24.16) v1(52.84,30.86) v1(52.84,24.16)
GND: length 121
  Top Layer w0.203: U2.9 40.47,18.12 v1(40.08,17.73) 39.65,17.73 39.47,17.91 U2.11 ; U6.1 21.3,19.14 v1(21.54,19.38)
  Top Layer w0.254: C20.2 40.53,29.23 39.7,28.4 39.7,27.51 40.34,26.88 40.34,26.12 40.03,25.81 U4.2 ; C20.2 41.29,29.23 41.8,28.71 U4.8 ; C20.2 42.56,30.94 L4.1 L3.1 39.84,33.35 ; C3.1 C4.1 C5.1 C6.1 14.57,27.97 R3.2 14.62,26.19 C10.2 14.62,20.47 16.4,18.68 17.73,18.68 C29.1 17.86,18 ; C3.1 C2.1 ; C3.1 12.91,33.35 12.39,33.87 LED1.1 ; v1(26.37,9.22) 27.45,9.22 C24.1 ; 39.84,33.35 v1(38.43,33.35) 37.51,34.28 35.7,34.28 ; 39.84,33.35 39.83,33.35 ; U1.27 19.59,34.28 v1(17.92,35.95) ; C2.1 14.49,35.26 v1(13.11,35.26) ; C2.1 C1.1 14.62,39.7 15.83,40.91 ; 17.86,18 C28.1 ; 17.86,18 17.87,17.99 U6.7 ; 29.65,36.33 29.65,34.78 v1(29.92,34.5) ; v1(26.24,8.08) 26.24,7.28 U5.1 ; C27.2 v1(32.34,3.89) ; U1.74 33.61,21.19 33.61,18.62 34.56,17.67 v1(34.56,16.46) v1(34.56,15.57) ; 29.3,3.72 29.3,4.96 v1(28.55,5.71) ; 15.83,40.91 C8.1 19.77,40.91 L2.2 ; 15.83,40.91 13.55,43.19 13.55,47.02 ; v1(28.55,5.71) 28.3,5.46 28.3,3.72 ; v1(28.55,5.71) 29.3,5.71 29.87,6.29 29.87,6.65 30.12,6.89 30.48,6.89 U5.18 ; v1(29.92,2.62) 29.92,2.3 29.36,1.73 ; C12.2 42.37,19.7 C14.1 41.84,18.46 U2.9 ; U2.11 39.47,19.56 C13.1 ; C25.1 v1(24.84,7.57)
  Inner2 w0.254: v1(38.43,33.35) 37.59,34.2 30.22,34.2 v1(29.92,34.5)
  Bottom Layer w0.254: v1(17.92,35.95) 17.86,35.89 13.29,35.89 13.11,35.71 v1(13.11,35.26) ; v1(34.56,15.57) 34.46,15.57 30,11.12 30,9.99
  vias: v1(14.68,34.04) v1(27.64,6.56) v1(27.64,4.78) v1(29.47,6.56) v1(29.49,4.78) v1(30.81,3.01)
GND_VDA: length 7.7
  Top Layer w0.254: 24.65,36.33 24.65,40.54 24.27,40.91 C7.1 23.01,41.1 L2.1
VBAT: length 6.8
  Top Layer w0.762: 36.4,2.37 36.78,2.37 38.04,3.62 40.38,3.62 40.49,3.51 40.5,3.51 SW4.1
(no net):
  vias: v1(6.3,26.12) v1(6.43,23.19) v1(22.94,13.03) v1(24.08,12.53) v1(26.62,24.97) v1(32.85,11.89) v1(35.13,10.11)
CAN1_RX: length 4
  Top Layer w0.254: U4.4 38.64,24.51 37.87,25.28 35.7,25.28
CAN1_TX: length 4
  Top Layer w0.254: U4.1 38.52,26.45 37.84,25.78 35.7,25.78
CAN_H: length 6.7
  Top Layer w0.254: U4.7 42.32,25.81 R11.2 44.91,28.27 45.03,28.39 47.27,28.39 47.39,28.51
CAN_L: length 6.8
  Top Layer w0.254: 47.39,26.51 47.15,26.76 R11.1 44.78,25.99 43.95,25.16 U4.6
ESC_5V: length 7.5
  Top Layer w0.762: H4.2 50.88,6.84 SW4.3
I2C1_SCL: length 25.8
  Top Layer w0.254: 39,14.51 R4.2 ; 39,14.51 38.4,14.51 37.76,15.14 37.59,15.14 37.58,15.14 36.49,15.14 36.49,15.14 35.98,15.14 35.51,15.61 35.51,17.73 v1(34.62,18.62) ; 39,14.51 38.97,14.54 U2.1 ; v1(33.4,31.14) 33.4,31.89 33.85,32.34 35.64,32.34 35.7,32.28
  Bottom Layer w0.254: v1(34.62,18.62) 34.62,21.92 32.59,23.96 32.59,30.33 v1(33.4,31.14)
I2C1_SDA: length 22.8
  Top Layer w0.254: v1(33.48,24.84) 32.77,25.56 32.77,31.88 33.67,32.78 35.7,32.78 ; v1(35.51,18.75) 36.02,18.24 36.02,16.84 36.02,16.84 R5.2 37.83,15.82 U2.16
  Bottom Layer w0.254: v1(33.48,24.84) 33.48,23.57 34.98,22.07 34.98,19.28 v1(35.51,18.75)
I2C2_SCL: length 24.2
  Top Layer w0.254: U1.47 27.19,24.28 v1(28.4,23.07) ; 28.65,13.92 v1(28.41,13.92) ; U5.23 27.8,8.12 v1(28.4,8.72)
  Bottom Layer w0.254: v1(28.4,23.07) 28.4,14.19 28.41,14.18 v1(28.41,13.92) 28.4,13.91 v1(28.4,8.72)
I2C2_SDA: length 22.1
  Top Layer w0.254: 27.3,7.72 v1(27.3,8.59) ; U1.48 26.54,23.78 v1(27.26,23.07)
  Bottom Layer w0.254: v1(27.26,23.07) 27.26,12.41 v1(27.27,12.4) ; v1(27.3,8.59) 27.3,12.23
IST8310_RESET: length 15.9
  Top Layer w0.254: v1(36.98,18.75) 36.98,18.67 38.21,17.45 U2.14 ; 35.7,31.28 36.7,31.28 v1(37.16,30.81)
  Bottom Layer w0.254: v1(37.16,30.81) 37.16,18.93 v1(36.98,18.75)
NRF_CE: length 24.5
  Top Layer w0.254: CN1.2 5.68,44.13 v1(9.1,40.72) ; v1(17.86,37.93) 22.56,37.93 22.65,37.84 22.65,36.33
  Bottom Layer w0.254: v1(9.1,40.72) 15.07,40.72 v1(17.86,37.93)
NRF_IRQ: length 19.4
  Top Layer w0.254: v1(17.35,30.69) 17.95,31.28 U1.33 ; v1(4.4,29.42) 3.97,29.85 CN2.4
  Bottom Layer w0.254: v1(17.35,30.69) 14.05,30.69 12.78,29.42 v1(4.4,29.42)
NRST: length 27.3
  Top Layer w0.254: U7.1 19.73,48.76 v1(19.89,48.59) ; U7.1 16.47,47.02 C9.1 ; U7.1 18.21,51.08 R1.2 ; v1(26.11,37.93) 26.88,37.93 27.65,37.16 27.65,36.33
  Bottom Layer w0.254: v1(19.89,48.59) 20.43,48.59 20.69,48.34 20.69,38.18 20.94,37.93 v1(26.11,37.93)
OSC_IN: length 4.2
  Top Layer w0.254: X1.2 28.65,39.51 28.65,36.33
OSC_OUT: length 4.2
  Top Layer w0.254: 28.15,36.33 28.15,39.52 X1.1
OTG_FS_DM: length 26.4
  Top Layer w0.254: U1.70 31.65,17.49 30.77,16.62 28.74,16.62 26.33,14.2 13.07,14.2 12.27,13.41 12.27,12.86 12.11,12.7 12.11,12.57 11.83,12.29 11.83,12.17 D2.3
OTG_FS_DP: length 26.4
  Top Layer w0.254: U1.71 32.15,17.42 30.94,16.21 28.91,16.21 26.5,13.8 13.24,13.8 12.86,13.42 12.86,13.04 13.6,12.29 D2.1
SPI1_MISO: length 21.8
  Top Layer w0.254: U1.31 20.54,32.34 17.86,32.34 v1(17.61,32.59) ; CN1.4 6.38,40.13 v1(9.22,37.29)
  Inner2 w0.254: v1(17.61,32.59) 17.61,32.91 13.22,37.29 v1(9.22,37.29)
SPI1_MOSI: length 18.9
  Top Layer w0.254: CN2.3 3.78,31.85 v1(4.27,32.34) ; v1(17.35,31.83) 20.55,31.83 U1.32
  Bottom Layer w0.254: v1(17.35,31.83) 16.84,32.34 v1(4.27,32.34)
SPI1_NSS: length 19.2
  Top Layer w0.254: v1(4.27,34.62) 3.49,33.85 CN2.2 ; U1.29 19.08,33.28 18.62,33.73
  Bottom Layer w0.254: v1(18.49,33.86) 17.73,34.62 v1(4.27,34.62)
SPI1_SCK: length 22.2
  Top Layer w0.254: v1(8.84,39.32) 6.03,42.13 CN1.3 ; v1(17.61,33.73) 18.56,32.78 U1.30
  Inner2 w0.254: v1(17.61,33.73) 12.02,39.32 v1(8.84,39.32)
SPI2_MISO: length 9.3
  Top Layer w0.203: U6.5 20.37,16.69 20.75,17.07 20.75,19.61 21.62,20.47 21.62,22.25 21.8,22.43 22.89,22.43 23.15,22.18 U1.53
SPI2_MOSI: length 5.7
  Top Layer w0.254: v1(22.05,17.35) 22.04,17.34 U6.3 ; v1(23.7,18.37) 23.7,21.18 U1.54
  Bottom Layer w0.254: v1(23.7,18.37) 22.69,17.35 v1(22.05,17.35)
SPI2_NSS: length 3.8
  Top Layer w0.254: U6.2 21.67,17.99 22.18,18.5 22.18,21.2 U1.51
SPI2_SCK: length 5.7
  Top Layer w0.254: U1.52 22.69,21.19 22.69,17.1 22.27,16.69 U6.4
SWCLK: length 14.1
  Top Layer w0.254: 35.7,22.78 43.04,22.78 v1(43.51,22.31) ; v1(44.02,20.91) R9.1 46.06,19.01 H5.1
  Bottom Layer w0.254: v1(43.51,22.31) 43.51,21.42 v1(44.02,20.91)
SWDIO: length 19.5
  Top Layer w0.254: U1.72 32.67,21.25 32.67,22.38 32.85,22.56 34.37,22.56 35.26,21.67 46.95,21.67 R10.1 47.7,19.13 H5.2
TIM4_CH1: length 28.8
  Top Layer w0.254: H1.1 47.7,15.83 45.04,13.16 v1(32.97,13.16) ; U1.59 26.15,17.83 26.75,17.23 v1(29.16,17.23)
  Inner2 w0.254: v1(32.97,13.16) 29.16,16.97 v1(29.16,17.23)
TIM4_CH2: length 27.4
  Top Layer w0.254: v1(29.92,17.48) 29.47,17.93 26.83,17.93 26.65,18.11 U1.60
  Inner2 w0.254: v1(34.88,12.58) 34.83,12.58 v1(29.92,17.48)
  Bottom Layer w0.254: v1(34.88,12.58) 34.95,12.65 46.31,12.65 46.82,13.16 48.21,13.16 H2.1
TIM4_CH3: length 27.2
  Top Layer w0.254: U1.61 27.15,19 27.86,18.29 30,18.29 v1(30.05,18.24) ; H3.1 48.34,10.37 46.64,12.07 v1(36.15,12.07)
  Inner2 w0.254: v1(36.15,12.07) 36.15,12.14 v1(30.05,18.24)
TIM4_CH4: length 28.9
  Top Layer w0.254: v1(29.8,19.13) 27.9,19.13 27.65,19.38 U1.62
  Inner2 w0.254: 37.67,11.38 33.73,15.32 33.73,15.68 30.29,19.13 v1(29.8,19.13)
  Bottom Layer w0.254: H4.1 46.69,9.1 46.69,11.13 46.43,11.38 v1(37.67,11.38)
TIM9_CH1_RGB: length 5
  Top Layer w0.254: LED2.2 33.63,39.35 32.65,38.36 32.65,36.33
UART5_RX: length 31.9
  Top Layer w0.254: 35.7,26.28 37.33,26.28 38.56,27.51 v1(38.56,29.92)
  Bottom Layer w0.254: CN5.1 37.16,46.64 37.16,32.28 38.56,30.88 v1(38.56,29.92)
UART5_TX: length 33.6
  Top Layer w0.254: 35.77,24.71 35.7,24.78 34.94,24.78 34.17,25.56 v1(34.17,29.04)
  Bottom Layer w0.254: CN5.2 28.9,52.91 36.66,45.15 36.66,37.42 34.17,34.93 v1(34.17,29.04)
USART2_RX: length 36.5
  Top Layer w0.254: v1(22.81,34.5) 22.53,34.78 U1.26 ; CN3.1 3.43,9.02 v1(7.7,13.29)
  Inner2 w0.254: v1(22.81,34.5) 22.81,28.4 v1(7.7,13.29)
USART2_TX: length 35.5
  Top Layer w0.254: CN3.2 4.16,11.02 v1(7.32,14.18) ; v1(19.77,36.28) 19.82,36.33 22.15,36.33
  Inner2 w0.254: v1(19.77,36.28) 19.08,35.59 19.08,25.94 v1(7.32,14.18)
USART3_RX: length 40.8
  Top Layer w0.254: v1(25.1,22.81) 24.65,22.36 U1.56
  Inner2 w0.254: v1(25.1,22.81) 25.1,29.92 27.13,31.96 47.45,31.96 52.79,37.29 CN4.1
USART3_TX: length 43.5
  Top Layer w0.254: U1.55 v1(24.15,22.81)
  Inner2 w0.254: v1(24.15,22.81) 24.15,30.37 26.37,32.59 47.45,32.59 51.26,36.4 51.26,38.96 CN4.2
$1N3277: length 4.6
  Top Layer w0.254: U1.49 20.53,23.21 19.77,23.21 19.75,23.19 C10.1
$1N3303: length 4.8
  Top Layer w0.254: U1.73 33.15,16.48 C11.1
$1N3409: length 5.3
  Top Layer w0.254: R2.1 40.9,31.78 35.7,31.78
$1N3477: length 6.6
  Top Layer w0.254: R3.1 18.24,26.24 18.88,26.88 18.88,28.32 19.77,29.21 20.53,29.21 U1.37
$1N4200: length 1.8
  Top Layer w0.254: U2.10 39.97,19.01 40.78,19.83 C12.1
$1N5779: length 1.4
  Top Layer w0.254: LED1.2 9.96,33.91 R6.2
$1N6508: length 4.1
  Top Layer w0.254: USB1.A7 13.03,6.81 12.78,7.06 11.03,7.06 R8.2
$1N6514: length 1.8
  Top Layer w0.254: D2.4 11.7,8.05 R8.1
$1N6519: length 1.8
  Top Layer w0.254: D2.6 13.6,8.03 R7.1
$1N6527: length 13.7
  Top Layer w0.254: USB1.A6 12.6,6 12.6,5.31 13.94,3.96 18.19,3.96 18.37,4.14 18.37,6.94 17.33,7.98 R7.2
$1N7769: length 9.3
  Top Layer w0.635: D3.1 44.66,9.03 44.66,2.62 SW4.2
$1N7822: length 1.6
  Top Layer w0.508: R12.1 38.94,8.23 38.88,8.3
$1N8748: length 9.9
  Top Layer w0.254: SW3.2 0.86,21.43 0.86,15.56 1.4,15.02 CN3.4
$1N9159: length 6.4
  Top Layer w0.254: v1(28.53,2.87) 28.8,3.14 U5.10 ; v1(25.48,2.87) 24.84,3.51 C25.2
  Bottom Layer w0.254: v1(25.48,2.87) 28.52,2.87 v1(28.53,2.87)
$1N9286: length 5.4
  Top Layer w0.254: 29.3,7.72 29.3,8.34 29.48,8.51 31.45,8.51 32.36,7.6 32.36,6.39 C27.1

## Copper pours and planes (outline as drawn; the poured copper is in the pictures)
3.3V on Top Layer: 23.45,10.88 33.69,10.88 33.69,0.85 23.45,0.85
AGND on Bottom Layer: -1.06,61.8 56.47,61.8 56.47,-6.4 -1.06,-6.4
GND on Top Layer: -2.46,58.5 66.25,58.5 66.25,-3.22 -2.46,-3.22
GND on Bottom Layer: 23.7,10.49 33.73,10.49 33.73,1.1 23.7,1.1
GND on Inner1: 0.26,54.74 54.74,54.74 54.74,0.26 0.26,0.26
(no net) on Inner2: -6.02,55.71 62.95,55.71 62.95,-0.94 -6.02,-0.94
ESC_5V on Top Layer: 50.12,6.68 50.12,17.1 51.83,17.1 51.83,6.68
$1N7769 on Top Layer: 44.24,9.35 44.24,11.47 39.54,10.86 39.54,9.35

Small or netless copper shapes (teardrops, artwork), in the pictures only: 249 on Top Layer, 47 on Bottom Layer, 25 on Inner1, 20 on Inner2

## Text on the board
Top Layer: STM32F407VET6飞控 / Designed by Muli25946
Top Silkscreen Layer: Type-C | 3.3V | 5V | VCC | GND | TX | RX | SCK | MISO | CE | TIM4CH1 | SWD | H | L | 2 | 3 | 4 | 3V3 | CLK | DIO | CAN | BAT | MOSI | IRQ | NRF24L01_1 | NRF24L01_2 | NSS | ESC_5V | RESET | RGB | 气压计 | 罗盘 | 供电 | 串口电压选择 | 串口3 | 串口5 | 串口2
